# Altium schematic sheet SCH_CHIPI_RELAY.SchDoc
size A
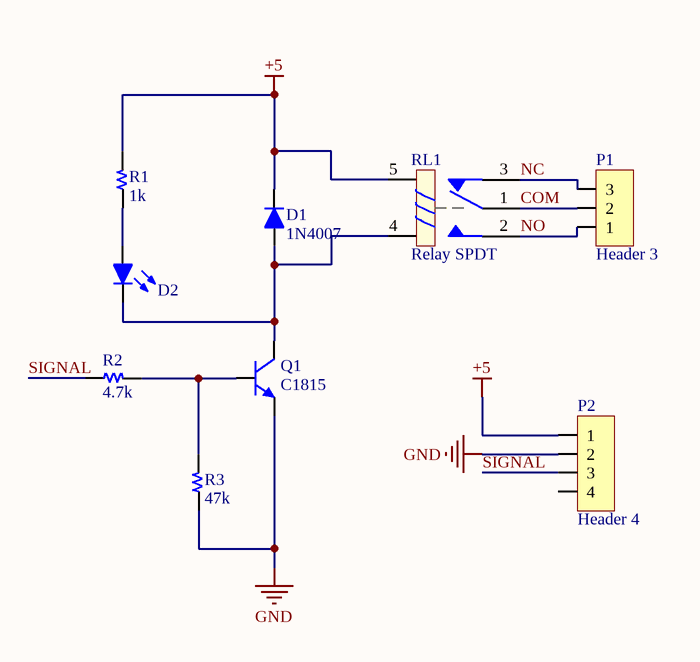
[diagram p0: SCH_CHIPI_RELAY.SchDoc]

## Parts
D1  1N4007  [Diode PowerDI123]
D2  Led  [Led 0805 RED]  (value not drawn)
P1  Header 3  [HDR/Terminal/3]
P2  Header 4  [HDR/Header/4/BOX/RED]
Q1  C1815  [SOT-23]
R1  1k  [R 0805]
R2  4.7k  [R 0805]
R3  47k  [R 0805]
RL1  Relay SPDT  [RL_SPDT_10A]

## Nets
+5: D1.2(K) P2.1 R1.2 RL1.5(COIL2)
GND: P2.2 Q1.2(E) R3.1
COM: P1.2 RL1.1(COM)
NC: P1.3 RL1.3(NC)
NO: P1.1 RL1.2(NO)
SIGNAL: P2.3 R2.1
NetD1_1: D1.1(A) D2.2(K) Q1.3(C) RL1.4(COIL1)
NetD2_1: D2.1(A) R1.1
NetQ1_1: Q1.1(B) R2.2 R3.2

Not connected (* = marked no-connect by the designer): P2 4

## Library data of the parts
D1 = Diode: Default Diode
D2 = Led: Typical LED
P1 = Header 3: Header, 3-Pin
P2 = Header 4: Header, 4-Pin
Q1 = Transistor NPN: NPN Bipolar Transistor
R1-R3 = Resistor